# Altium schematic sheet usb-can.SchDoc
size A4; SheetNumber: 5; SheetTotal: 5
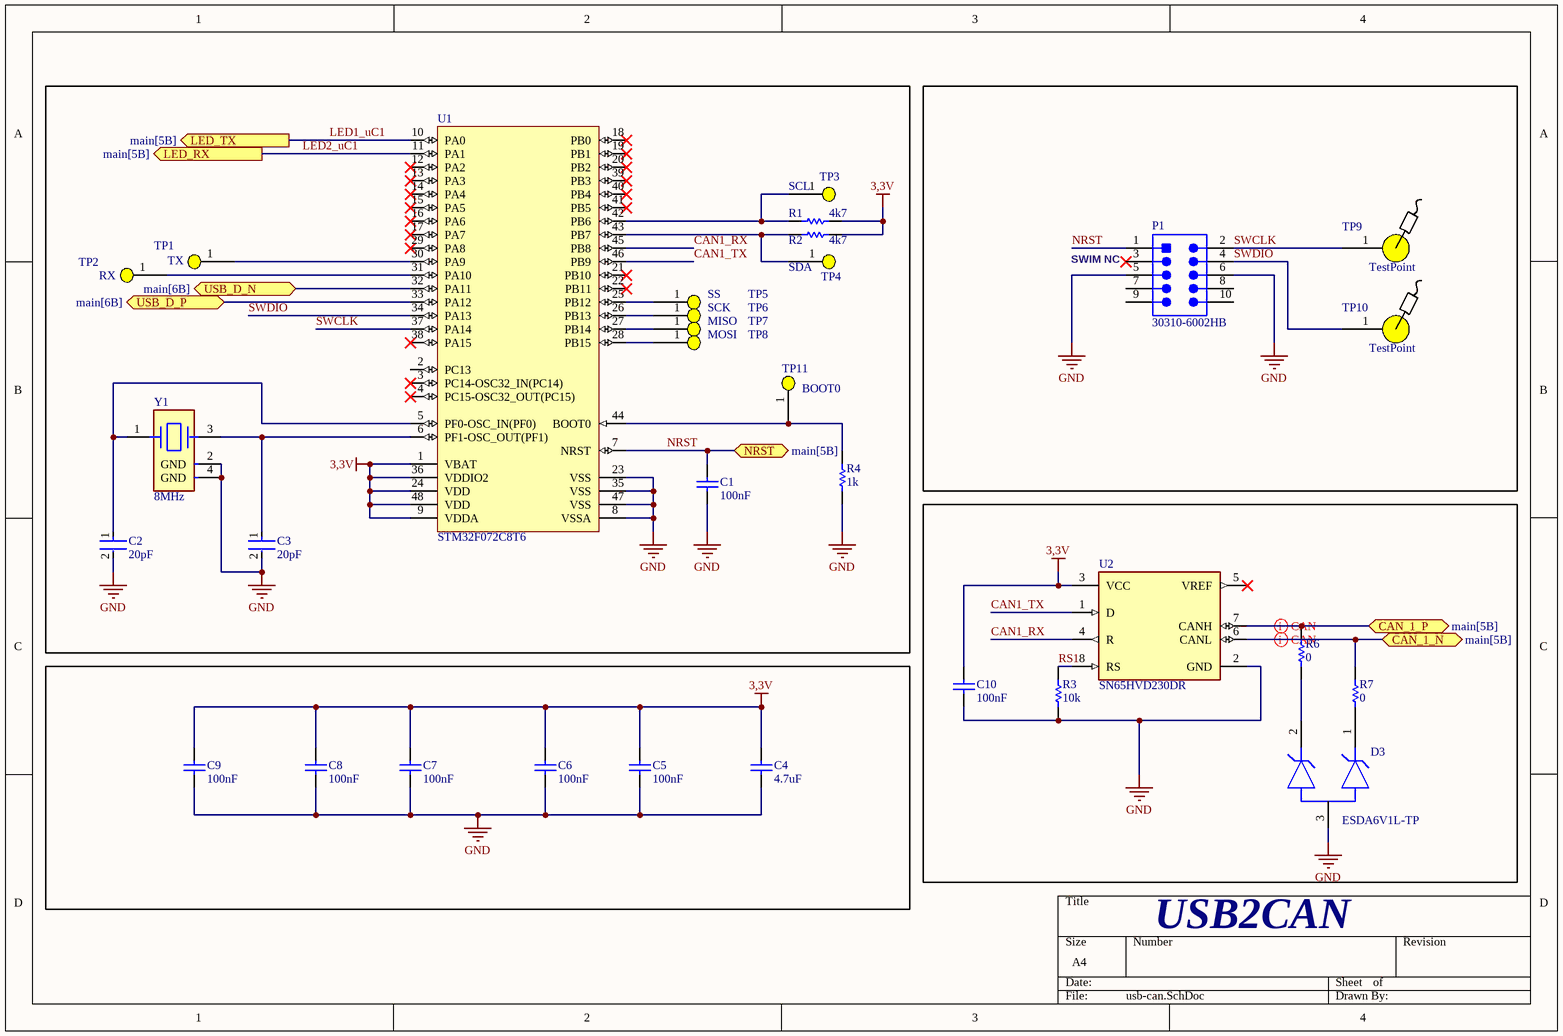
[diagram p0: usb-can.SchDoc]

## Parts
C1  100nF  [CAPC2013X88X50LL20T25]
C2  20pF  [FP-C0603C-CF-MFG]
C3  20pF  [FP-C0603C-CF-MFG]
C4  4.7uF  [CAPC2013X88X50LL20T25]
C5  100nF  [CAPC2013X88X50LL20T25]
C6  100nF  [CAPC2013X88X50LL20T25]
C7  100nF  [CAPC2013X88X50LL20T25]
C8  100nF  [CAPC2013X88X50LL20T25]
C9  100nF  [CAPC2013X88X50LL20T25]
C10  100nF  [CAPC2013X88X50LL20T25]
D3  ESDA6V1L-TP  [FP-SOT-23-MFG]
P1  30310-6002HB  [3M-30310-6002HB-10_V]
R1  4k7  [RESC0603(1608)_N]
R2  4k7  [RESC0603(1608)_N]
R3  10k  [RESC0603(1608)_N]
R4  1k  [RESC0603(1608)_N]
R6  value 0  [RESC1005X40X25ML05T10]  (hidden comment: Resistor 0R 0402 63 mW)
R7  value 0  [RESC1005X40X25ML05T10]  (hidden comment: Resistor 0R 0402 63 mW)
TP1  TX  [TestPoint]
TP2  RX  [TestPoint]
TP3  SCL  [TestPoint]
TP4  SDA  [TestPoint]
TP5  SS  [TestPoint]
TP6  SCK  [TestPoint]
TP7  MISO  [TestPoint]
TP8  MOSI  [TestPoint]
TP9  TestPoint  [TestPoint]
TP10  TestPoint  [TestPoint]
TP11  BOOT0  [TestPoint]
U1  STM32F072C8T6  [STM-LQFP48_M]
U2  SN65HVD230DR  [FP-D0008A-IPC_A]
Y1  8MHz  [FP-7M-MFG]

## Blocks framed on the sheet
SWIM NC: P1 TP9 TP10

## Ports
CAN_1_N (bidir, see main[5B]), CAN_1_P (bidir, see main[5B]), LED_RX (out, see main[5B]), LED_TX (out, see main[5B]), NRST (bidir, see main[5B]), USB_D_N (bidir, see main[6B]), USB_D_P (bidir, see main[6B])

## Nets
3,3V: C4.2 C5.2 C6.2 C7.2 C8.2 C9.2 C10.2 R1.1 R2.1 U1.1(VBAT) U1.9(VDDA) U1.24(VDD) U1.36(VDDIO2) U1.48(VDD) U2.3(VCC)
GND: C1.1 C2.2 C3.2 C4.1 C5.1 C6.1 C7.1 C8.1 C9.1 C10.1 D3.3 P1.5 P1.6 R3.1 R4.1 U1.8(VSSA) U1.23(VSS) U1.35(VSS) U1.47(VSS) U2.2(GND) Y1.2(GND) Y1.4(GND)
CAN1_RX: U1.45(PB8) U2.4(R)
CAN1_TX: U1.46(PB9) U2.1(D)
CAN_1_N: R7.2 U2.6(CANL) ; port CAN_1_N
CAN_1_P: R6.2 U2.7(CANH) ; port CAN_1_P
LED1_uC1: U1.10(PA0) ; port LED_TX
LED2_uC1: U1.11(PA1) ; port LED_RX
NRST: C1.2 P1.1 U1.7(NRST) ; port NRST
RS1: R3.2 U2.8(RS)
SWCLK: P1.2 TP9.1 U1.37(PA14)
SWDIO: P1.4 TP10.1 U1.34(PA13)
USB_D_N: U1.32(PA11) ; port USB_D_N
USB_D_P: U1.33(PA12) ; port USB_D_P
NetC2_1: C2.1 U1.5(PF0-OSC_IN(PF0)) Y1.1
NetC3_1: C3.1 U1.6(PF1-OSC_OUT(PF1)) Y1.3
NetD3_1: D3.1 R7.1
NetD3_2: D3.2 R6.1
NetR1_2: R1.2 TP3.1 U1.42(PB6)
NetR2_2: R2.2 TP4.1 U1.43(PB7)
NetR4_2: R4.2 TP11.1 U1.44(BOOT0)
NetTP1_1: TP1.1 U1.30(PA9)
NetTP2_1: TP2.1 U1.31(PA10)
NetTP5_1: TP5.1 U1.25(PB12)
NetTP6_1: TP6.1 U1.26(PB13)
NetTP7_1: TP7.1 U1.27(PB14)
NetTP8_1: TP8.1 U1.28(PB15)

Not connected (* = marked no-connect by the designer): P1 3* 7 8 9 10; U1 2(PC13) 3(PC14-OSC32_IN(PC14))* 4(PC15-OSC32_OUT(PC15))* 12(PA2)* 13(PA3)* 14(PA4)* 15(PA5)* 16(PA6)* 17(PA7)* 18(PB0)* 19(PB1)* 20(PB2)* 21(PB10)* 22(PB11)* 29(PA8)* 38(PA15)* 39(PB3)* 40(PB4)* 41(PB5)*; U2 5(VREF)*

## Layout directives
differential pair; differential pair class CAN: CAN_1_N, CAN_1_P

## Notes on the sheet
- USB2CAN

## Library data of the parts
C1 C4-C10 = CMP-2007-00266-1: Manufacturer: Kemet; Part Number: C0805C103K5RACTU
C2 C3 = CMP-2006-03061-2: CAP CER 0.1UF 50V X7R 0603; Manufacturer: KEMET; Manufacturer Part Number: C0603C104K5RACTU; Tolerance: 0.1; Temperature Coefficient: 30ppm/°C; Material: Ceramic; Automotive Grade: Grade 1; Value: 0.10 μF; Temperature: -55°C to +125°C; RoHS: TRUE; Temperature Range High: +125°C; Lead Free: Yes; Octopart: https://octopart.com/c0603c104k5ractu-kemet-139244; Digikey Description: CAP CER 0.1UF 50V X7R 0603; Category: Cap; Package: C0603C-CF; ComponentLink2Description: Datasheet; Temperature Range Low: -55°C; Device Class L1: Passive Components; Voltage Rating: 50 V; Automotive: Yes; Device Class L3: Ceramic Capacitors; ComponentLink2URL: https://api.kemet.com/component-edge/download/datasheet/C0603C100J5GACAUTO.pdf; Capacitance: 0.10 μF; Device Class L2: Capacitors; Temperature Characteristic: X7R; Height: 0.87mm
D3 = CMP-56244-000002-1: TVS DIODE 5.25V SOT23; Power Dissipation: 300W; Direction: Unidirectional; Breakdown Voltage: 6.65V; Capacitance: 140pF; Element Configuration: Common Anode; Number of Channels: 2; Min Breakdown Voltage: 6.1V; Max Breakdown Voltage: 7.2V; Power Line Protection: No; Leakage Current: 20uA; Peak Pulse Power: 300W; Lead Free: Lead Free; Composition: Zener; Package Quantity: 1; Reverse Standoff Voltage: 5.25V; Working Voltage: 5.25V; Packaging: Tape and Reel; Case/Package: SOT-23; Mount: Surface Mount; Radiation Hardening: No; Number of Unidirectional Channels: 2; Number of Pins: 3; Max Operating Temperature: 150°C; Min Operating Temperature: -55°C; Depth: 1.4mm; Length: 3.04mm; Termination: SMD/SMT
P1 = CMP-2000-05031-1: Male Header, Pitch 2.54 mm, 2 x 5 Position, Height 9.3 mm, Tail Length 2.79 mm, -55 to 105 degC, RoHS, Bulk; Manufacturer: 3M; Current Rating: 1A; Brand: 3MElectronicSolutionsDivision; Mounting Angle: Straight; Number of Positions: 10Position; Mating Post Length: 5.99mm; Pitch: 2.54mm; Manufacturer URL: http://www.3m.com/; Factory Pack Quantity: 1000; Mounting Style: StraightPin; Number of Rows: 2Row; Termination Post Length: 2.79mm; Contact Gender: Pin(Male); Contact Material: Brass; Termination Style: ThroughHole; Product: Headers; Packaging: Tray; Product Category: Headers&WireHousings; Type: Shrouded; Datasheet URL: http://datasheet.octopart.com/30310-6002HB-3M-datasheet-11537585.pdf; Datasheet Version: Apr-12; Contact Plating: Gold; Row Spacing: 2.54mm; Housing Material: Polyester; Series: 303; RoHS: Details
R1-R4 = CMP-1012-00081-1: 2K 0.1W 5% 0603 (1608 Metric)  SMD; Case-Metric: 1608; Value: 2000.00 Ohm; Case-EIA: 0603; Tolerance: 5 %; Technology: SMT; Power: 0.1 W
R6 R7 = CMP-009-00004-5: Chip Resistor, 0 Ohm, 0.063 W, -55 to 155 degC, 0402 (1005 Metric); Power: 63mW; Voltage Rating: 50V; Max Operating Temperature: 155°C; Pins: 2; RoHS Compliant: True; Min Operating Temperature: -55°C; Mounting Technology: SM; Case/Package: 0402
TP1-TP8 TP11 = TestPoint
U1 = CMP-0304-00166-4: ARM Cortex-M0 32-bit MCU, 64 KB Flash, 16 KB Internal RAM, 37 I/Os, 48-Pin LQFP, -40 to 85 degC, Tray; Manufacturer: STMicroelectronics; Operating Frequency(F) (Processor speed) (MHz): 48; FLASH Size (Prog) (kB): 64; I/Os (High Current): 37; D/A Converter: 1; Internal RAM Size (kB): 16; Supply Voltage(Vcc) min (V): 2; Package Reference: LQFP48; DatasheetVersion: Rev. 5; Core: ARM Cortex-M0; ComponentLink1Description: Manufacturer URL; ComponentLink1URL: http://www.st.com/; Packing: Tray; Mounting Technology: Surface Mount; Package Description: 48-Pin Low Profile Quad Flat Package, Body 7 x 7 mm, Pitch 0.5 mm; ComponentLink2URL: http://www.st.com/st-web-ui/static/active/en/resource/technical/document/datasheet/DM00090510.pdf; ComponentLink2Description: Datasheet; PartNumber: STM32F072C8T6
U2 = CMP-0315-00015-3: IC TRANSCEIVER HALF 1/1 8SOIC; Number of Transceivers: 1; Operating Supply Voltage: 3.3V; Number of I/Os: 2; Max Supply Current: 17mA; Max Supply Voltage: 3.6V; Min Supply Voltage: 3V; Data Rate: 1Mbps; Min Operating Temperature: -40°C; Packaging: Tape and Reel; Lead Free: Lead Free; Number of Transmit Buffers: 1; Max Operating Temperature: 85°C; Number of Receive Buffers: 1; Number of Pins: 8; Package Quantity: 1; Radiation Hardening: No; Case/Package: D; REACH SVHC: No SVHC; Weight: 0.002561oz; Termination: SMD/SMT; Contact Plating: Gold; Nominal Supply Current: 17mA; Number of Receivers: 1; Number of Drivers: 1
Y1 = CMP-18717-000311-1: Crystal; ESR (Equivalent Series Resistance): 100R; Frequency: 12MHz; Frequency Stability: 10ppm; Load Capacitance: 10pF; Width: 0.098inch; Number of Pins: 4; Case/Package: SMD/SMT; REACH SVHC: No SVHC; Mount: Surface Mount; Max Operating Temperature: 70°C; RoHS Compliant: Yes; Depth: 2.5mm; Length: 3.2mm; Termination: SMD/SMT; Frequency Tolerance: 10ppm; Min Operating Temperature: -20°C; Series: 7M; Packaging: Tape and Reel; Tolerance: 10ppm; Height: 0.031inch; Package Quantity: 3000